# EasyEDA schematic 1-Schematic_Smart Home.json
TITLE: Smart Home Borad using ESP12E; REV: 1.0; Date: 2023-06-20; Sheet: 1/1; Drawn By: Rayan Albalawi; Company: Tabuk University
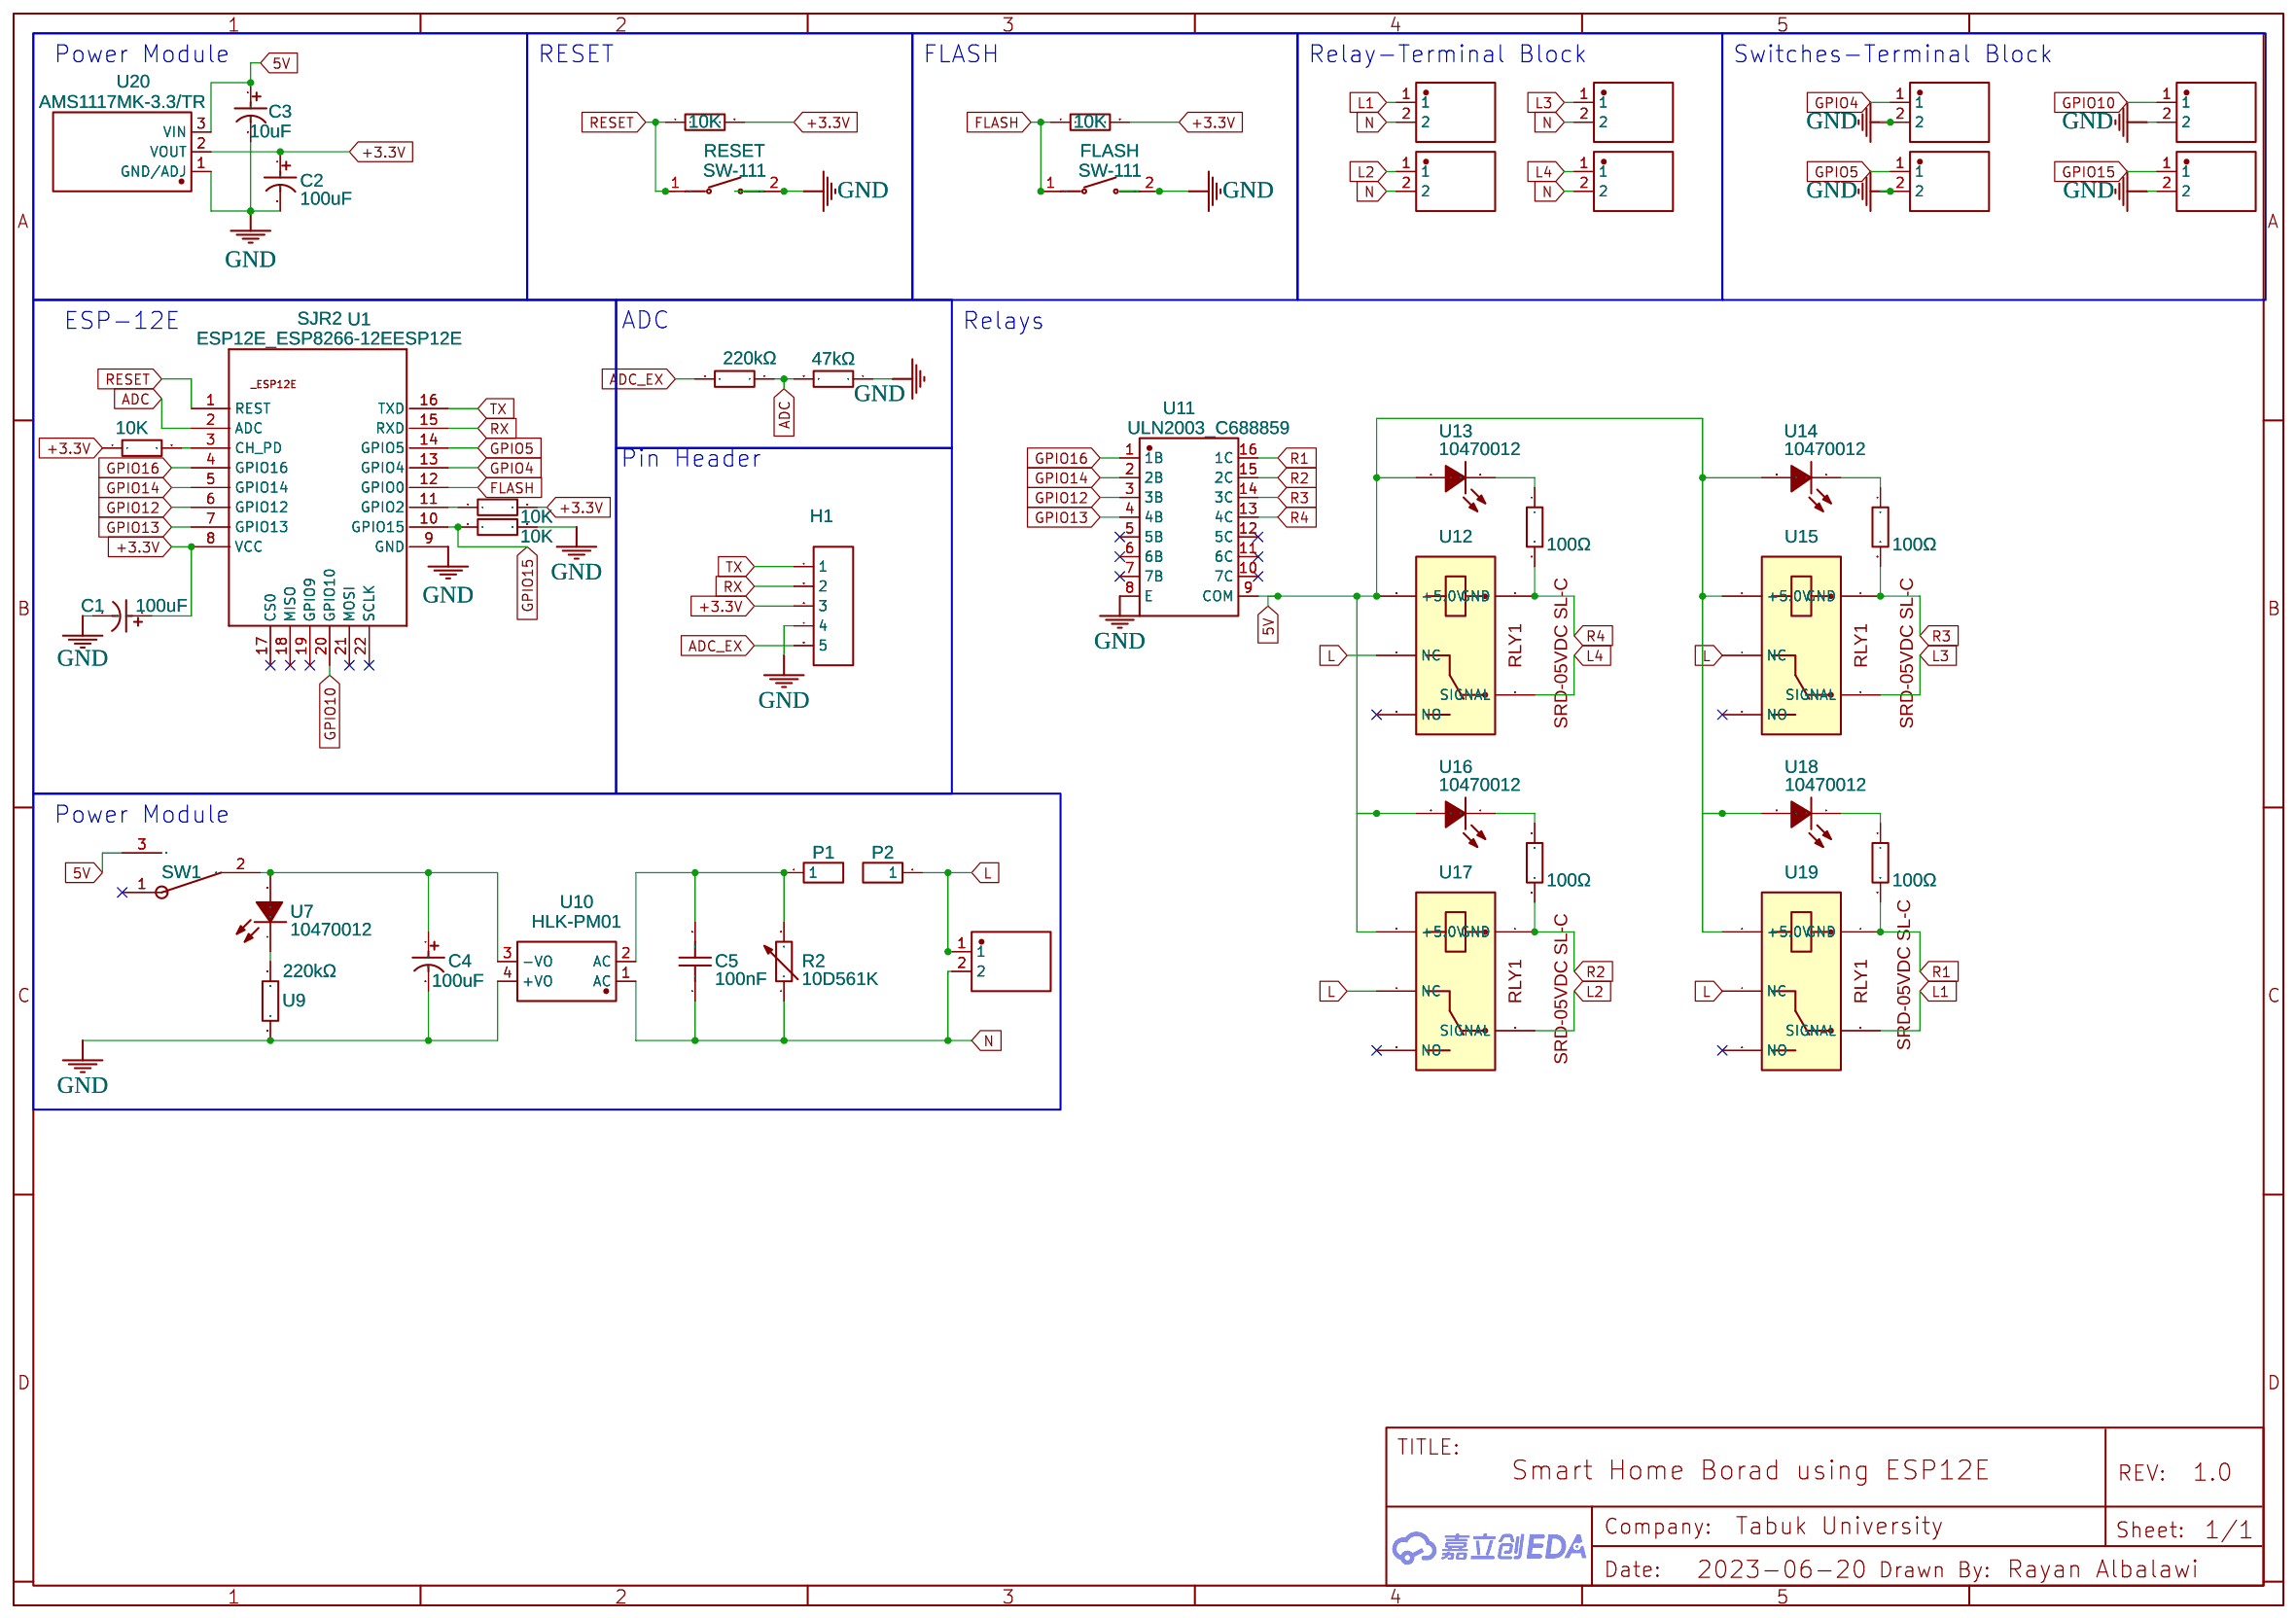
[diagram p0: schematic sheet]

## Parts
C1  100uF  [CAP-TH_BD6.3-P2.50-D0.5-FD]
C2  100uF  [CAP-TH_BD6.3-P2.50-D0.5-FD]
C3  10uF  [CAP-TH_BD6.3-P2.50-D0.5-FD]
C4  100uF  [CAP-TH_BD6.3-P2.50-D0.5-FD]
C5  100nF  [CAP-TH_L10.0-W4.0-P7.50-D0.8]
CN1  WJ127-5.0-2P_C187897  [CONN-TH_2P-P5.00_WJ127-5.0-2P]
CN2  WJ127-5.0-2P_C187897  [CONN-TH_2P-P5.00_WJ127-5.0-2P]
CN3  WJ127-5.0-2P_C187897  [CONN-TH_2P-P5.00_WJ127-5.0-2P]
CN4  WJ127-5.0-2P_C187897  [CONN-TH_2P-P5.00_WJ127-5.0-2P]
CN5  WJ127-5.0-2P_C187897  [CONN-TH_2P-P5.00_WJ127-5.0-2P]
CN6  WJ127-5.0-2P_C187897  [CONN-TH_2P-P5.00_WJ127-5.0-2P]
CN7  WJ127-5.0-2P_C187897  [CONN-TH_2P-P5.00_WJ127-5.0-2P]
CN8  WJ127-5.0-2P_C187897  [CONN-TH_2P-P5.00_WJ127-5.0-2P]
CN9  WJ127-5.0-2P_C187897  [CONN-TH_2P-P5.00_WJ127-5.0-2P]
FLASH  SW-111  [SW-TH_SW-111]
H1  Header-Female-2.54_1x5  [HDR-TH_5P-P2.54-V-F]
P1  Header-Male-2.54_1x1  [HDR-TH_1P-P2.54-V-M]
P2  Header-Male-2.54_1x1  [HDR-TH_1P-P2.54-V-M]
R1  47kΩ  [RES-TH_BD4.5-L11.5-P15.50-D0.7]
R2  10D561K  [RES-TH_L13.0-W6.0-P7.50-D0.9-S6.00]
R3  100Ω  [RES-TH_BD4.5-L11.5-P15.50-D0.7]
R4  100Ω  [RES-TH_BD4.5-L11.5-P15.50-D0.7]
R5  100Ω  [RES-TH_BD4.5-L11.5-P15.50-D0.7]
R6  100Ω  [RES-TH_BD4.5-L11.5-P15.50-D0.7]
RESET  SW-111  [SW-TH_SW-111]
SJR2  ESP12E_ESP8266-12EESP12E  [ESP12E_ESP8266-ESP12E]
SW1  EG1218  [SW-TH_EG1218]
U1  10K  [RES-TH_BD2.5_NTC-10K]
U3  10K  [RES-TH_BD2.5_NTC-10K]
U4  10K  [RES-TH_BD2.5_NTC-10K]
U5  10K  [RES-TH_BD2.5_NTC-10K]
U6  10K  [RES-TH_BD2.5_NTC-10K]
U7  10470012  [LED0805-RD]
U8  220kΩ  [RES-TH_BD5.0-L15.5-P19.50-D0.7]
U9  220kΩ  [RES-TH_BD5.0-L15.5-P19.50-D0.7]
U10  HLK-PM01  [PWRM-TH_HLK-PM01]
U11  ULN2003_C688859  [SOIC-16_L9.9-W3.9-P1.27-LS6.0-BL]
U12  SRD-05VDC SL-C BY JMAD COPY  [RELAI SRD-03VDC SL-C BY JMAD]
U13  10470012  [LED0805-RD]
U14  10470012  [LED0805-RD]
U15  SRD-05VDC SL-C BY JMAD COPY  [RELAI SRD-03VDC SL-C BY JMAD]
U16  10470012  [LED0805-RD]
U17  SRD-05VDC SL-C BY JMAD COPY  [RELAI SRD-03VDC SL-C BY JMAD]
U18  10470012  [LED0805-RD]
U19  SRD-05VDC SL-C BY JMAD COPY  [RELAI SRD-03VDC SL-C BY JMAD]
U20  AMS1117MK-3.3/TR  [SOT-89_L4.5-W2.5-P1.50-LS4.2-BR]

## Library data of the parts
C1-C4 = 100uF 35V 6.3*11_C45076: Supplier Part: C45076; Supplier: LCSC; Manufacturer: ValuePro; Manufacturer Part: 100uF 35V 6.3*11; JLCPCB Part Class: Extended Part
C5 = B32520C3104K000: Supplier: LCSC; Supplier Part: C125382; Manufacturer: TDK; Contributor: LCSC; JLCPCB Part Class: Extended Part
CN1-CN9 = WJ127-5.0-2P_C187897: Supplier: LCSC; Supplier Part: C187897; Manufacturer: Ningbo Kangnex Elec; Manufacturer Part: WJ127-5.0-2P; Contributor: LCSC
FLASH RESET = SW-111: Supplier: LCSC; Supplier Part: C294475; Manufacturer: Shinmei(日本神明); Contributor: LCSC; JLCPCB Part Class: Extended Part
H1 = Header-Female-2.54_1x5: Supplier: LCSC; Manufacturer: BOOMELE(博穆精密); Manufacturer Part: 2.54-1*5P母; Supplier Part: C50950; JLCPCB Part Class: Extended Part
P1 P2 = Header-Male-2.54_1x1: Supplier: LCSC; Manufacturer: BOOMELE(博穆精密); Manufacturer Part: 2.54-1*1P针; Supplier Part: C81276; JLCPCB Part Class: Extended Part
R1 R3-R6 = MOF2WS-47KΩ±5% T: Supplier: LCSC; Manufacturer: CCO(千志电子); Resistance (Ohms): 47K; Contributor: LCSC; Supplier Part: C121703; JLCPCB Part Class: Extended Part
R2 = 10D561K: Supplier: LCSC; Manufacturer: HEL(鸿志); Supplier Part: C113236; JLCPCB Part Class: Extended Part
SJR2 = ESP12E_ESP8266-12EESP12E: Contributor: darwin_vargas
SW1 = EG1218: Supplier: LCSC; Supplier Part: C273394; Manufacturer: E-Switch; Contributor: LCSC; JLCPCB Part Class: Extended Part
U1 U3-U6 = B3950-10K 1%: Supplier: LCSC; Supplier Part: C9900005609; Manufacturer: null; JLCPCB Part Class: Extended Part; Contributor: LCSC
U7 U13 U14 U16 U18 = 10470012: Supplier: LCSC; Supplier Part: C9900018803; Manufacturer: null; JLCPCB Part Class: Extended Part; Contributor: lcsc
U8 U9 = MOF3WS-100KΩ±5% T: Supplier: LCSC; Manufacturer: CCO(千志电子); Resistance (Ohms): 100K; Contributor: LCSC; Supplier Part: C121880; JLCPCB Part Class: Extended Part
U10 = HLK-PM01: Supplier: LCSC; Supplier Part: C209903; Manufacturer: HI-LINK(海凌科); Contributor: LCSC; JLCPCB Part Class: Extended Part
U11 = ULN2003_C688859: Supplier: LCSC; Supplier Part: C688859; Manufacturer: IDCHIP(英锐芯); Manufacturer Part: ULN2003; Contributor: LCSC; JLCPCB Part Class: Extended Part
U12 U15 U17 U19 = SRD-05VDC SL-C BY JMAD COPY: Supplier Part: SRD-05VDC SL-C; Contributor: youssefmohsen
U20 = AMS1117MK-3.3/TR: Supplier: LCSC; Supplier Part: C498147; Manufacturer: HGC(华冠); Contributor: LCSC; JLCPCB Part Class: Extended Part

## Nets
5V: C3.1 SW1.3 U11.9(COM) U12.2(+5.0V) U13.2(A) U14.2(A) U15.2(+5.0V) U16.2(A) U17.2(+5.0V) U18.2(A) U19.2(+5.0V) U20.3(VIN)
+3.3V: C1.1 C2.1 H1.3 SJR2.8(VCC) U1.1 U3.2 U5.2 U6.2 U20.2(VOUT)
GND: C1.2 C2.2 C3.2 C4.2 CN5.2 CN6.2 CN7.2 CN8.2 FLASH.2 H1.4 R1.1 RESET.2 SJR2.9(GND) U4.2 U9.1 U10.4(+VO) U11.8(E) U20.1(GND/ADJ)
ADC: R1.2 SJR2.2(ADC) U8.1
ADC_EX: H1.5 U8.2
FLASH: FLASH.1 SJR2.12(GPIO0) U6.1
GPIO4: CN8.1 SJR2.13(GPIO4)
GPIO5: CN7.1 SJR2.14(GPIO5)
GPIO10: CN6.1 SJR2.20(GPIO10)
GPIO12: SJR2.6(GPIO12) U11.3(3B)
GPIO13: SJR2.7(GPIO13) U11.4(4B)
GPIO14: SJR2.5(GPIO14) U11.2(2B)
GPIO15: CN5.1 SJR2.10(GPIO15) U4.1
GPIO16: SJR2.4(GPIO16) U11.1(1B)
L: CN9.1 P2.1 U12.4(NC) U15.4(NC) U17.4(NC) U19.4(NC)
L1: CN1.1 U19.5(SIGNAL)
L2: CN2.1 U17.5(SIGNAL)
L3: CN3.1 U15.5(SIGNAL)
L4: CN4.1 U12.5(SIGNAL)
N: C5.1 CN1.2 CN2.2 CN3.2 CN4.2 CN9.2 R2.1 U10.1(AC)
R1: R6.2 U11.16(1C) U19.1(GND)
R2: R5.2 U11.15(2C) U17.1(GND)
R3: R4.2 U11.14(3C) U15.1(GND)
R4: R3.2 U11.13(4C) U12.1(GND)
RESET: RESET.1 SJR2.1(REST) U5.1
RX: H1.2 SJR2.15(RXD)
TX: H1.1 SJR2.16(TXD)
Net-(C4-1): C4.1 SW1.2 U7.2(A) U10.3(-VO)
Net-(C5-2): C5.2 P1.1 R2.2 U10.2(AC)
Net-(R3-1): R3.1 U13.1(K)
Net-(R4-1): R4.1 U14.1(K)
Net-(R5-1): R5.1 U16.1(K)
Net-(R6-1): R6.1 U18.1(K)
Net-(SJR2-3): SJR2.3(CH_PD) U1.2
Net-(SJR2-11): SJR2.11(GPIO2) U3.1
Net-(U7-1): U7.1(K) U9.2

Not connected (* = marked no-connect by the designer): SJR2 17(CS0)* 18(MISO)* 19(GPIO9)* 21(MOSI)* 22(SCLK)*; SW1 1*; U11 5(5B)* 6(6B)* 7(7B)* 10(7C)* 11(6C)* 12(5C)*; U12 3(NO)*; U15 3(NO)*; U17 3(NO)*; U19 3(NO)*

## Notes on the sheet
- Power Module
- RESET
- FLASH
- Relay-Terminal Block
- Switches-Terminal Block
- ESP-12E
- ADC
- Relays
- Pin Header
- Power Module
